# EAGLE design 3DPrinter-PowerDistribution (EAGLE 6.3)
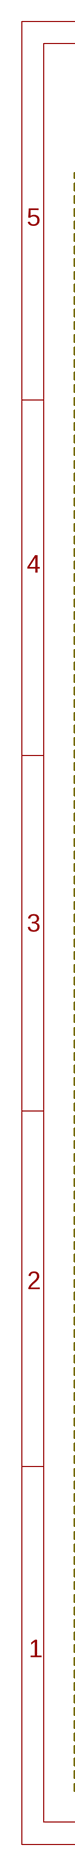
[diagram p0: schematic, sheet 1, part 1 of 2]
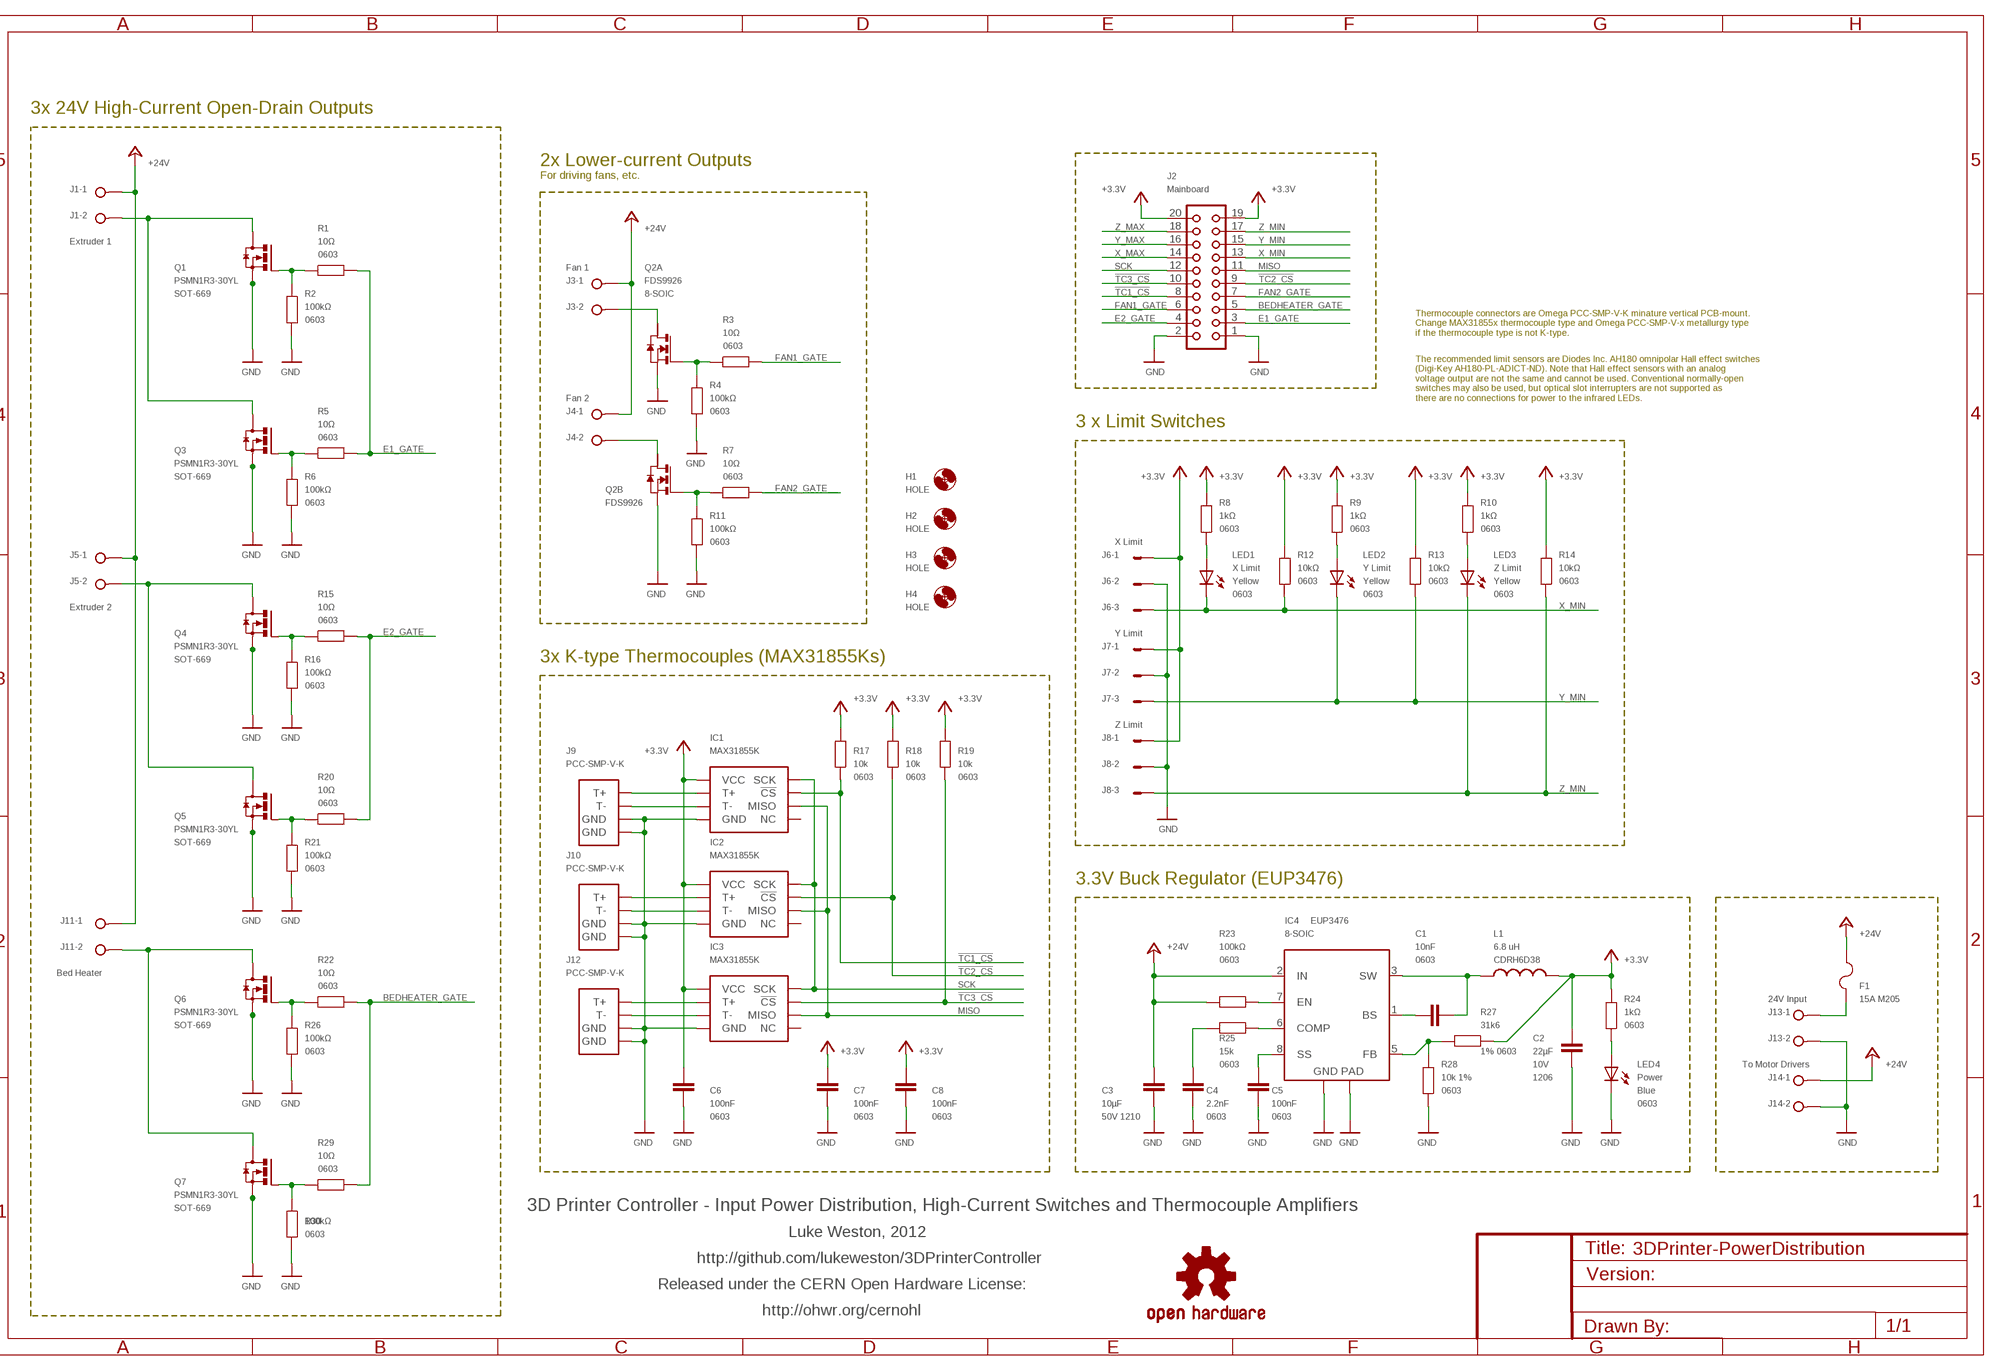
[diagram p1: schematic, sheet 1, part 2 of 2]

## Parts
C1  10nF  CAP0603  [0603]
C2  22µF  C-EUC1206K  [C1206K]
C3  10µF  C-EUC1210K  [C1210K]
C4  2.2nF  CAP0603  [0603]
C5  100nF  CAP0603  [0603]
C6  100nF  CAP0603  [0603]
C7  100nF  CAP0603  [0603]
C8  100nF  CAP0603  [0603]
F1  15A M205  FUSESHK20L  [SHK20L]
H1  HOLE  MOUNT-HOLE3.2  [3,2]
H2  HOLE  MOUNT-HOLE3.2  [3,2]
H3  HOLE  MOUNT-HOLE3.2  [3,2]
H4  HOLE  MOUNT-HOLE3.2  [3,2]
IC1  MAX31855K  MCLENG_MAX6675MAX31855  [MCLENG_SOIC-8]
IC2  MAX31855K  MCLENG_MAX6675MAX31855  [MCLENG_SOIC-8]
IC3  MAX31855K  MCLENG_MAX6675MAX31855  [MCLENG_SOIC-8]
IC4  EUP3476  [SO08T]
J1  Extruder 1  W237-02P  [W237-132]
J2  Mainboard  CON20L  [CON20L]
J3  Fan 1  W237-02P  [W237-132]
J4  Fan 2  W237-02P  [W237-132]
J5  Extruder 2  W237-02P  [W237-132]
J6  X Limit  22-05-7038-03  [7395-03]
J7  Y Limit  22-05-7038-03  [7395-03]
J8  Z Limit  22-05-7038-03  [7395-03]
J9  PCC-SMP-V-K  MCLAUGHLINENG_TC_JACK  [MCLAUGHLINENG_TC_JACK]
J10  PCC-SMP-V-K  MCLAUGHLINENG_TC_JACK  [MCLAUGHLINENG_TC_JACK]
J11  Bed Heater  W237-02P  [W237-132]
J12  PCC-SMP-V-K  MCLAUGHLINENG_TC_JACK  [MCLAUGHLINENG_TC_JACK]
J13  24V Input  W237-02P  [W237-132]
J14  To Motor Drivers  W237-02P  [W237-132]
L1  6.8 uH  INDUCTOR  [CDRH]
LED1  X Limit  LED0603  [LED-0603]
LED2  Y Limit  LED0603  [LED-0603]
LED3  Z Limit  LED0603  [LED-0603]
LED4  Power  LED0603  [LED-0603]
Q1  PSMN1R3-30YL  PH7030L  [SOT669]
Q2  FDS9926  NMOS2SM8  [SM8]
Q3  PSMN1R3-30YL  PH7030L  [SOT669]
Q4  PSMN1R3-30YL  PH7030L  [SOT669]
Q5  PSMN1R3-30YL  PH7030L  [SOT669]
Q6  PSMN1R3-30YL  PH7030L  [SOT669]
Q7  PSMN1R3-30YL  PH7030L  [SOT669]
R1  10Ω  RESISTOR0603  [0603]
R2  100kΩ  RESISTOR0603  [0603]
R3  10Ω  RESISTOR0603  [0603]
R4  100kΩ  RESISTOR0603  [0603]
R5  10Ω  RESISTOR0603  [0603]
R6  100kΩ  RESISTOR0603  [0603]
R7  10Ω  RESISTOR0603  [0603]
R8  1kΩ  RESISTOR0603  [0603]
R9  1kΩ  RESISTOR0603  [0603]
R10  1kΩ  RESISTOR0603  [0603]
R11  100kΩ  RESISTOR0603  [0603]
R12  10kΩ  RESISTOR0603  [0603]
R13  10kΩ  RESISTOR0603  [0603]
R14  10kΩ  RESISTOR0603  [0603]
R15  10Ω  RESISTOR0603  [0603]
R16  100kΩ  RESISTOR0603  [0603]
R17  10k  RESISTOR0603  [0603]
R18  10k  RESISTOR0603  [0603]
R19  10k  RESISTOR0603  [0603]
R20  10Ω  RESISTOR0603  [0603]
R21  100kΩ  RESISTOR0603  [0603]
R22  10Ω  RESISTOR0603  [0603]
R23  100kΩ  RESISTOR0603  [0603]
R24  1kΩ  RESISTOR0603  [0603]
R25  15k  RESISTOR0603  [0603]
R26  100kΩ  RESISTOR0603  [0603]
R27  31k6  RESISTOR0603  [0603]
R28  10k 1%  RESISTOR0603  [0603]
R29  10Ω  RESISTOR0603  [0603]
R30  100kΩ  RESISTOR0603  [0603]
SY  OSHW-LOGOS  [OSHW-LOGO-S]

## Nets
!TC1_CS: IC1.CS(!CS) J2.8 R17.2
!TC2_CS: IC2.CS(!CS) J2.9 R18.2
!TC3_CS: IC3.CS(!CS) J2.10 R19.2
+3.3V: C2.1 C6.1 C7.1 C8.1 IC1.VCC IC2.VCC IC3.VCC J2.19 J2.20 J6.1 J7.1 J8.1 L1.2 R8.1 R9.1 R10.1 R12.1 R13.1 R14.1 R17.1 R18.1 R19.1 R24.1 R27.1
+24V: C3.1 F1.2A IC4.2(IN) J1.1 J3.1 J4.1 J5.1 J11.1 J14.1 R23.2
BEDHEATER_GATE: J2.5 R22.1 R29.1
E1_GATE: J2.3 R1.1 R5.1
E2_GATE: J2.4 R15.1 R20.1
FAN1_GATE: J2.6 R3.1
FAN2_GATE: J2.7 R7.1
GND: C2.2 C3.2 C4.1 C5.1 C6.2 C7.2 C8.2 IC1.GND IC2.GND IC3.GND IC4.4(GND) IC4.9(TGND) J2.1 J2.2 J6.2 J7.2 J8.2 J9.P$1(GND) J9.P$2(GND) J10.P$1(GND) J10.P$2(GND) J12.P$1(GND) J12.P$2(GND) J13.2 J14.2 LED4.C Q1.1(S) Q1.2(S) Q1.3(S) Q2.1(B:S) Q2.3(A:S) Q3.1(S) Q3.2(S) Q3.3(S) Q4.1(S) Q4.2(S) Q4.3(S) Q5.1(S) Q5.2(S) Q5.3(S) Q6.1(S) Q6.2(S) Q6.3(S) Q7.1(S) Q7.2(S) Q7.3(S) R2.2 R4.2 R6.2 R11.2 R16.2 R21.2 R26.2 R28.2 R30.2
J5: J11.2 Q6.MB(D) Q7.MB(D)
MISO: IC1.SO(MISO) IC2.SO(MISO) IC3.SO(MISO) J2.11
N$1: Q3.4(G) R5.2 R6.1
N$2: J1.2 Q1.MB(D) Q3.MB(D)
N$3: Q4.4(G) R15.2 R16.1
N$4: J5.2 Q4.MB(D) Q5.MB(D)
N$5: Q5.4(G) R20.2 R21.1
N$6: F1.1A J13.1
N$7: Q6.4(G) R22.2 R26.1
N$8: IC1.T+ J9.T+
N$9: Q7.4(G) R29.2 R30.1
N$10: J3.2 Q2.5(A:D)
N$11: IC1.T- J9.T-
N$12: J4.2 Q2.7(B:D)
N$13: Q2.4(A:G) R3.2 R4.1
N$14: Q2.2(B:G) R7.2 R11.1
N$15: LED1.A R8.2
N$16: LED2.A R9.2
N$17: LED3.A R10.2
N$21: LED4.A R24.2
N$22: Q1.4(G) R1.2 R2.1
N$28: IC3.T- J12.T-
N$29: IC3.T+ J12.T+
N$32: IC2.T- J10.T-
N$33: IC2.T+ J10.T+
N$42: IC4.7(EN) R23.1
N$44: C1.1 IC4.3(SW) L1.1
N$51: C1.2 IC4.1(BS)
N$59: C4.2 R25.2
N$61: IC4.6(COMP) R25.1
N$62: C5.2 IC4.8(SS)
N$63: IC4.5(FB) R27.2 R28.1
SCK: IC1.SCK IC2.SCK IC3.SCK J2.12
X_MAX: J2.14
X_MIN: J2.13 J6.3 LED1.C R12.2
Y_MAX: J2.16
Y_MIN: J2.15 J7.3 LED2.C R13.2
Z_MAX: J2.18
Z_MIN: J2.17 J8.3 LED3.C R14.2
Unconnected: IC1.NC IC2.NC IC3.NC Q2.6(A:D2) Q2.8(B:D2)

## Notes on the sheet
- 3x 24V High-Current Open-Drain Outputs
- 2x Lower-current Outputs
- For driving fans, etc.
- Thermocouple connectors are Omega PCC-SMP-V-K minature vertical PCB-mount.
  Change MAX31855x thermocouple type and Omega PCC-SMP-V-x metallurgy type
  if the thermocouple type is not K-type.
- The recommended limit sensors are Diodes Inc. AH180 omnipolar Hall effect switches
  (Digi-Key AH180-PL-ADICT-ND). Note that Hall effect sensors with an analog
  voltage output are not the same and cannot be used. Conventional normally-open
  switches may also be used, but optical slot interrupters are not supported as
  there are no connections for power to the infrared LEDs.
- 3 x Limit Switches
- 3x K-type Thermocouples (MAX31855Ks)
- 3.3V Buck Regulator (EUP3476)
- 3D Printer Controller - Input Power Distribution, High-Current Switches and Thermocouple Amplifiers
- Luke Weston, 2012
- http://github.com/lukeweston/3DPrinterController
- Released under the CERN Open Hardware License:
- http://ohwr.org/cernohl

## Library data of the parts
C1 C4-C8 = freetronics-master-v1:CAP: Capacitor Standard 0603 ceramic capacitor, and 0.1" leaded capacitor.; PACKAGE: 0603
C2 = freetronics-jon:C-EU: CAPACITOR, European symbol; PACKAGE: 1206; VOLTAGE: 10V
C3 = freetronics-jon:C-EU: CAPACITOR, European symbol; VOLTAGE: 50V 1210
F1 = fuse:FUSE: Fuse; OC_FARNELL: unknown; OC_NEWARK: unknown
H1-H4 = holes:MOUNT-HOLE: MOUNTING HOLE with drill center marker
IC1-IC3 = RAMPSdisplay:MCLENG_MAX6675
IC4 = freetronics-luke:EUP3476: EUTECH EUP3476 buck converter; PACKAGE: 8-SOIC
J1 J3-J5 J11 J13 J14 = con-wago-508:W237-02P: WAGO SREW CLAMP; OC_FARNELL: unknown; OC_NEWARK: unknown
J2 = con-harting:CON20L: CONNECTOR; OC_FARNELL: unknown; OC_NEWARK: unknown
J6-J8 = con-molex:22-?-03: CONNECTOR wire to board 2.54 mm (.1 inch) pitch header; OC_FARNELL: unknown; OC_NEWARK: unknown
J9 J10 J12 = RAMPSdisplay:MCLAUGHLINENG_TC_JACK
L1 = freetronics-luke:INDUCTOR; PACKAGE: CDRH6D38
LED1-LED3 = freetronics-master-v1:LED: LEDs Standard schematic elements and footprints for 5mm, 3mm, 1206, and 0603 sized LEDs. 5mm - Spark Fun Electronics SKU : COM-00529 (and others); COLOUR: Yellow; PACKAGE: 0603
LED4 = freetronics-master-v1:LED: LEDs Standard schematic elements and footprints for 5mm, 3mm, 1206, and 0603 sized LEDs. 5mm - Spark Fun Electronics SKU : COM-00529 (and others); COLOUR: Blue; PACKAGE: 0603
Q1 Q3-Q7 = transistor-power:PH7030L: N-channel TrenchMOS (TM) logic level FET Source: http://www.nxp.com/acrobat_download/datasheets/PH7030L_4.pdf; PACKAGE: SOT-669
Q2 = zetex:NMOS2SM8: Dual MOS FET; OC_FARNELL: unknown; OC_NEWARK: unknown; PACKAGE: 8-SOIC
R1-R26 R28-R30 = freetronics-master-v1:RESISTOR: Resistor Basic schematic elements and footprints for 0603, 1206, and PTH 1/10th watt (small) resistors.; PACKAGE: 0603
R27 = freetronics-master-v1:RESISTOR: Resistor Basic schematic elements and footprints for 0603, 1206, and PTH 1/10th watt (small) resistors.; PACKAGE: 1% 0603
SY = SparkFun:OSHW-LOGO: Open Source Hardware Logo This logo indicates the piece of hardware it is found on incorporates a OSHW license and/or adheres to the definition of open source hardware found here: http://freedomdefined.org/OSHW

## Board
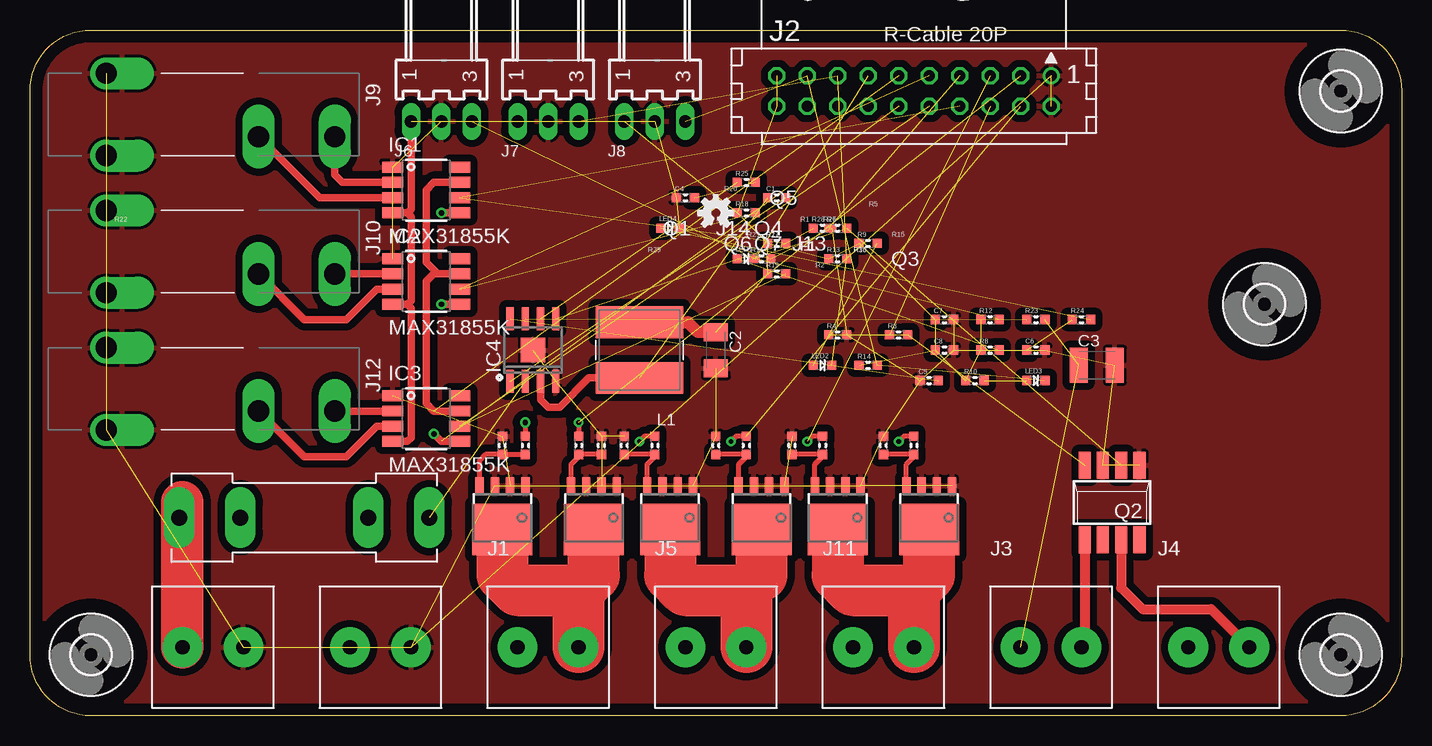
[diagram p2: board, top side]
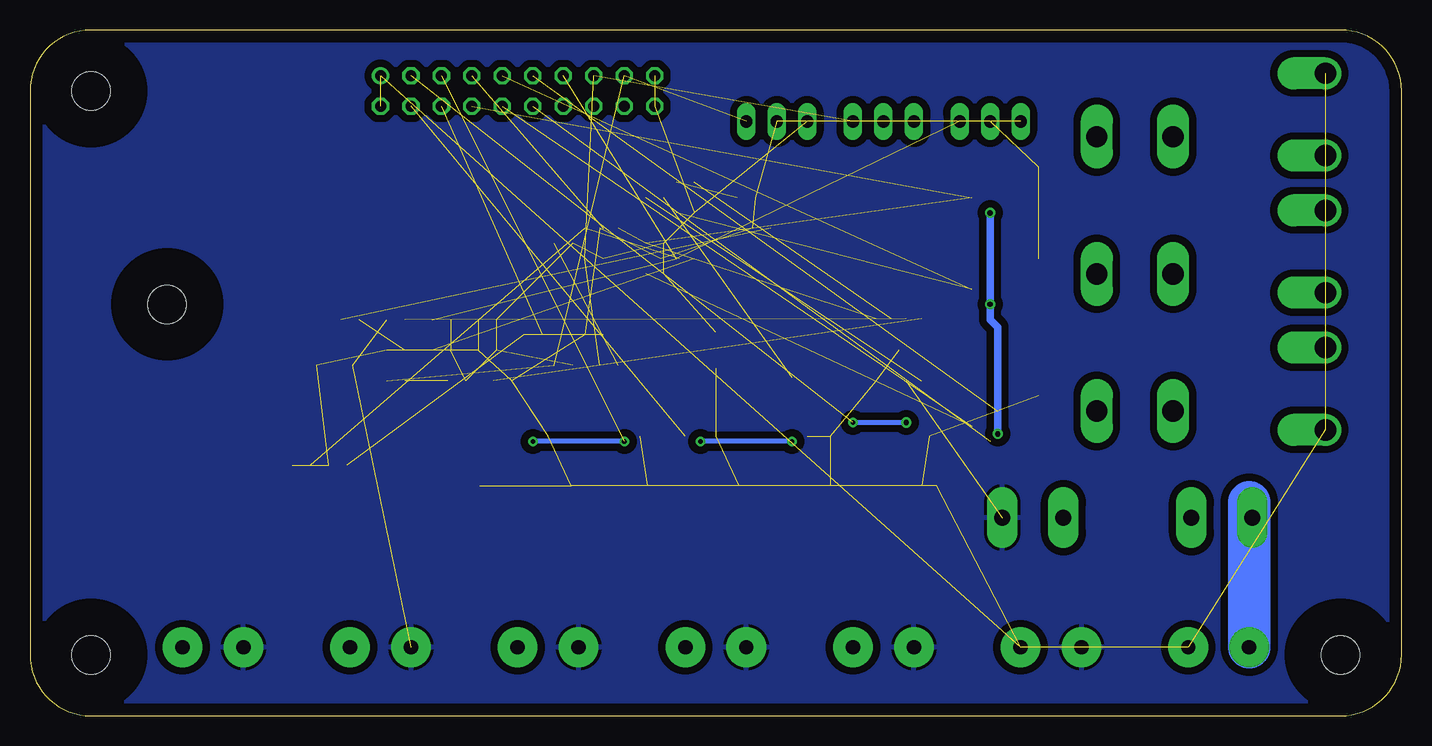
[diagram p3: board, bottom side, seen from below]

Size 114.3 x 57.15 mm. Coordinates in mm from the lower left corner, seen from the top.
Outline: 0,52.07 arc-90 5.08,57.15 109.22,57.15 arc-90 114.3,52.07 114.3,5.08 arc-90 109.22,0 5.08,0 arc-90 0,5.08 0,52.07
Copper layers (1*16): Top 0.035mm / dielectric 1.5mm / Bottom 0.035mm
Design rules "default": minimum track width 10mil, minimum drill 24mil, track to track 8mil, track to pad 8mil, pad to pad 8mil, via to via 8mil, smd to smd 8mil, copper to edge 40mil, drill to drill 8mil, minimum pad ring 10mil, minimum via ring 8mil, stop-mask expansion 4mil, vias tented up to drill 0mil, thermal gap 10mil

### Footprints (pad centres in the part's own frame; a part is rotated, then mirrored left to right if it is on the bottom)
0603 = smd 0.762 x 0.762: 1 -0.762,0; 2 0.762,0
C1206K = smd 1.5 x 2: 1 -1.5,0; 2 1.5,0
C1210K = smd 1.5 x 2.9: 1 -1.5,0; 2 1.5,0
SHK20L = drill 1.321 pad 2.54 long: 1A -10.414,0; 1B -5.334,0; 2A 10.414,0; 2B 5.334,0
3,2 = hole 3.2: 0,0
MCLENG_SOIC-8 = smd 1.778 x 0.914: CS 2.794,-0.635; GND -2.794,1.905; NC 2.794,1.905; SCK 2.794,-1.905; SO 2.794,0.635; T+ -2.794,-0.635; T- -2.794,0.635; VCC -2.794,-1.905
SO08T = smd 1.905 x 0.6: 1 -2.6,1.905; 2 -2.6,0.635; 3 -2.6,-0.635; 4 -2.6,-1.905; 5 2.6,-1.905; 6 2.6,-0.635; 7 2.6,0.635; 8 2.6,1.905 | smd 2.057 x 2.057: 9 0,0
W237-132 = drill 1.2 pad 3.302: 1 -2.54,-0.635; 2 2.54,-0.635
CON20L = drill 0.914: 1 11.43,1.27 | drill 0.914 octagon: 2 11.43,-1.27; 3 8.89,1.27; 4 8.89,-1.27; 5 6.35,1.27; 6 6.35,-1.27; 7 3.81,1.27; 8 3.81,-1.27; 9 1.27,1.27; 10 1.27,-1.27; 11 -1.27,1.27; 12 -1.27,-1.27; 13 -3.81,1.27; 14 -3.81,-1.27; 15 -6.35,1.27; 16 -6.35,-1.27; 17 -8.89,1.27; 18 -8.89,-1.27; 19 -11.43,1.27; 20 -11.43,-1.27
7395-03 = drill 1.016 long: 1 2.54,0; 2 0,0; 3 -2.54,0
MCLAUGHLINENG_TC_JACK = drill 1.778 offset: P$1 -5.283,0; P$2 1.575,0 | drill 1.778 long: T+ 0,12.7; T- 0,19.05
CDRH = smd 7.3 x 2.65: 1 0,2.325; 2 0,-2.325
LED-0603 = smd 0.762 x 0.762: A -0.762,0; C 0.762,0
SOT669 = smd 0.7 x 1.4: 1 -1.905,-2.65; 2 -0.635,-2.65; 3 0.635,-2.65; 4 1.905,-2.65 | smd 5 x 4.3: MB 0,1
SM8 = smd 1.016 x 2.235: 1 -2.286,-3.099; 2 -0.762,-3.099; 3 0.762,-3.099; 4 2.286,-3.099; 5 2.286,3.099; 6 0.762,3.099; 7 -0.762,3.099; 8 -2.286,3.099

### Placement (x,y rotation side)
C1  62.23,43.18 0 top
C2  57.15,30.48 270 top
C3  88.9,29.21 0 top
C4  54.61,43.18 0 top
C5  74.93,27.94 0 top
C6  83.82,30.48 0 top
C7  76.2,33.02 0 top
C8  76.2,30.48 0 top
F1  22.86,16.51 0 top
H1  5.08,5.08 0 top
H2  102.87,34.29 0 top
H3  109.22,5.08 0 top
H4  109.22,52.07 0 top
IC1  33.02,43.81 0 top
IC2  33.02,36.2 0 top
IC3  33.02,24.77 0 top
IC4  41.91,30.48 90 top
J1  43.18,6.35 0 top
J2  73.66,52.07 0 top
J3  85.09,6.35 0 top
J4  99.06,6.35 0 top
J5  57.15,6.35 0 top
J6  34.29,49.53 180 top
J7  43.18,49.53 180 top
J8  52.07,49.53 180 top
J9  6.35,48.26 270 top
J10  6.35,36.83 270 top
J11  71.12,6.35 0 top
J12  6.35,25.4 270 top
J13  15.24,6.35 0 top
J14  29.21,6.35 0 top
L1  50.8,30.48 180 top
LED1  59.69,38.1 0 top
LED2  66.04,29.21 0 top
LED3  83.82,27.94 0 top
LED4  53.34,40.64 0 top
Q1  46.99,16.51 180 top
Q2  90.17,17.78 180 top
Q3  39.37,16.51 180 top
Q4  60.96,16.51 180 top
Q5  53.34,16.51 180 top
Q6  74.93,16.51 180 top
Q7  67.31,16.51 180 top
R1  45.72,22.54 270 top
R2  47.62,22.54 90 top
R3  72.39,31.75 0 top
R4  67.31,31.75 0 top
R5  41.27,22.54 270 top
R6  39.37,22.54 90 top
R7  67.31,40.64 0 top
R8  80.01,30.48 0 top
R9  69.85,39.37 0 top
R10  78.74,27.94 0 top
R11  60.96,38.1 0 top
R12  80.01,33.02 0 top
R13  67.31,38.1 0 top
R14  69.85,29.21 0 top
R15  59.69,22.54 270 top
R16  57.15,22.54 90 top
R17  62.23,39.37 0 top
R18  59.69,41.91 0 top
R19  62.23,36.83 0 top
R20  52.07,22.54 270 top
R21  49.53,22.54 90 top
R22  73.66,22.54 270 top
R23  83.82,33.02 0 top
R24  87.63,33.02 0 top
R25  59.69,44.45 0 top
R26  71.12,22.54 90 top
R27  62.23,39.37 0 top
R28  66.04,40.64 0 top
R29  66.04,22.54 270 top
R30  63.5,22.54 90 top
SY  57.15,41.91 0 top

### Tracks (layer width: path | path; a pad name or v marks a point on that pad's centre or on a via)
!TC1_CS  (2 unrouted)
!TC2_CS  (2 unrouted)
!TC3_CS  (2 unrouted)
+3.3V  (18 unrouted)
  Top 0.61: 31.43,41.91 31.75,42.23 J6.1 | 31.43,41.91 IC1.VCC | IC2.VCC 31.43,34.29 | 31.43,34.29 31.75,34.61 31.75,41.59 31.43,41.91 | IC3.VCC 31.43,22.86 31.75,23.18 31.75,33.97 31.43,34.29
  Top 1.016: L1.2 54.83,32.8 55.65,31.98 C2.1
+24V  (3 unrouted)
  pour Bottom (isolate 0.61): 0,57.15 114.3,57.15 114.3,0 0,0
BEDHEATER_GATE  (via drill 0.4)  (1 unrouted)
  Top 0.406: R22.1 72.83,23.3 v72.39,22.86 | R29.1 65.22,23.3 v64.77,22.86
  Bottom 0.406: v64.77,22.86 v72.39,22.86
E1_GATE  (via drill 0.4, 0.44)  (1 unrouted)
  Top 0.406: 41.27,23.5 R5.1 v41.27,24.45 | v45.72,24.45 45.72,23.5 45.53,23.5 R1.1
  Bottom 0.406: v45.72,24.45 v41.27,24.45
E2_GATE  (via drill 0.4)  (1 unrouted)
  Top 0.406: R15.1 58.86,23.3 v58.42,22.86 | R20.1 51.24,23.3 v50.8,22.86
  Bottom 0.406: v50.8,22.86 v58.42,22.86
FAN1_GATE  (1 unrouted)
FAN2_GATE  (1 unrouted)
GND  (54 unrouted)
  pour Top (isolate 0.61): 0,57.15 114.3,57.15 114.3,0 0,0
J5
  Top 4.318: Q7.MB 67.31,11.75 68.58,10.48 73.66,10.48 | 73.66,10.48 J11.2 | 73.66,10.48 74.93,11.75 Q6.MB
MISO  (1 unrouted)
  Top 0.61: IC1.SO 33.66,44.45 33.02,43.81 33.02,37.78 33.97,36.83 IC2.SO 33.66,36.83 33.02,36.2 33.02,26.04 33.66,25.4 IC3.SO
N$1
  Top 0.406: R5.2 R6.1 37.97,21.78 37.47,21.27 Q3.4
N$2
  Top 0.406: Q1.MB 46.99,15.24
  Top 4.318: J1.2 45.72,10.48 | 45.72,10.48 46.99,11.75 46.99,15.24 | Q3.MB 39.37,11.75 40.64,10.48 45.72,10.48
N$3
  Top 0.406: Q4.4 59.05,20.95 59.69,21.59 R15.2 R16.1
N$4
  Top 3.556: 59.69,10.48 60.96,11.75
  Top 4.318: Q5.MB 53.34,11.75 54.61,10.48 59.69,10.48 J5.2 | 60.96,11.75 Q4.MB
N$5
  Top 0.406: Q5.4 51.44,20.95 52.07,21.59 R20.2 R21.1
N$6
  Top 3.556: J13.1 12.7,17.78
  Bottom 2.032: 12.7,17.78 12.7,18.03 F1.1A
  Bottom 3.556: J13.1 12.7,17.78
N$7
  Top 0.406: Q6.4 73.03,20.95 73.66,21.59 R22.2 R26.1
N$8
  Top 0.61: IC1.T+ 24.13,43.18 J9.T+
N$9
  Top 0.406: Q7.4 65.41,20.95 66.04,21.59 R29.2 R30.1
N$10
  Top 0.813: Q2.5 87.88,5.97 J3.2
N$11
  Top 0.61: IC1.T- 26.04,44.45 25.4,45.09 J9.T-
N$12
  Top 0.813: Q2.7 90.93,10.67 92.71,8.89 98.42,8.89 J4.2
N$13  (2 unrouted)
N$14  (2 unrouted)
N$15  (1 unrouted)
N$16  (1 unrouted)
N$17  (1 unrouted)
N$21  (1 unrouted)
N$22
  Top 0.406: Q1.4 45.09,20.95 45.72,21.59 R1.2 R2.1
N$28
  Top 0.61: IC3.T- J12.T-
N$29
  Top 0.61: IC3.T+ 28.89,24.13 26.35,21.59 22.86,21.59 J12.T+
N$32
  Top 0.61: J10.T- IC2.T-
N$33
  Top 0.61: IC2.T+ 28.89,35.56 26.35,33.02 22.86,33.02 J10.T+
N$42  (1 unrouted)
N$44  (1 unrouted)
  Top 0.61: L1.1 46.57,28.16 44.13,25.72 43.18,25.72 42.55,26.35 IC4.3
N$51  (1 unrouted)
N$59  (1 unrouted)
N$61  (1 unrouted)
N$62  (1 unrouted)
N$63  (2 unrouted)
SCK  (via drill 0.44)  (1 unrouted)
  Top 0.61: IC3.SCK 34.29,22.86 v33.66,23.5 | IC2.SCK v34.29,34.29 | v34.29,41.91 IC1.SCK
  Bottom 0.61: v33.66,23.5 33.66,32.38 34.29,33.02 v34.29,34.29 v34.29,41.91
X_MIN  (3 unrouted)
Y_MIN  (3 unrouted)
Z_MIN  (3 unrouted)